# EAGLE schematic DC_bias_circuit (EAGLE 7.5.0)
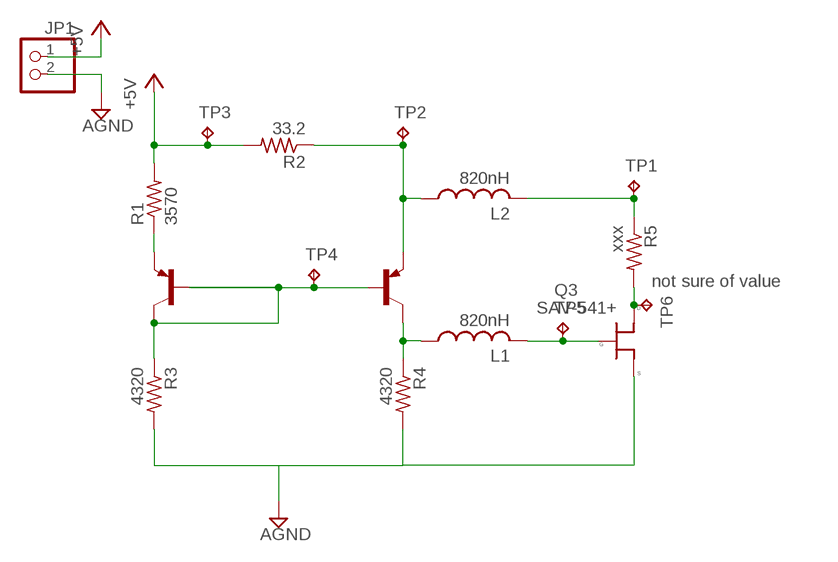
[diagram p0: schematic, sheet 1]

## Parts
JP1  PINHD-1X2  [1X02]
L1  820nH  L-USL3225M  [L3225M]
L2  820nH  L-USL3225M  [L3225M]
Q1  MMBT3906LT1SMD  [SOT23-BEC]
Q2  MMBT3906LT1SMD  [SOT23-BEC]
Q3  SAV-541+  [SOT-343]
R1  3570  R-US_M1206  [M1206]
R2  33.2  R-US_M1206  [M1206]
R3  4320  R-US_M1206  [M1206]
R4  4320  R-US_M1206  [M1206]
R5  xxx  R-US_M1206  [M1206]
TP1  TPB1,27  [B1,27]
TP2  TPB1,27  [B1,27]
TP3  TPB1,27  [B1,27]
TP4  TPB1,27  [B1,27]
TP5  TPB1,27  [B1,27]
TP6  TPB1,27  [B1,27]

## Nets
+5V: JP1.1 R1.2 R2.2 TP3.TP
GND: JP1.2 Q3.2(S) Q3.4(S) R3.2 R4.2 ; supply symbol labelled AGND
N$1: Q1.B Q1.C Q2.B R3.1 TP4.TP
N$2: L1.1 Q2.C R4.1
N$4: Q1.E R1.1
N$6: L2.1 Q2.E R2.1 TP2.TP
N$7: L1.2 Q3.3(G) TP5.TP
N$8: Q3.1(D) R5.2 TP6.TP
N$9: L2.2 R5.1 TP1.TP

## Notes on the sheet
- not sure of value

## Library data of the parts
JP1 = pinhead:PINHD-1X2: PIN HEADER
L1 L2 = resistor:L-US: INDUCTOR, American symbol
Q1 Q2 = transistor-pnp:MMBT3906*: PNP Transistror
Q3 = ECE532_Parts:SAV-541+
R1-R5 = rcl:R-US_: RESISTOR, American symbol
TP1-TP6 = testpad:TP: Test pad